# EAGLE design CNC-DROBoard (EAGLE 6.4)
CNC Control Panel DRO Board SPI Master/Slave interface with slave priority to main MCU 7-Segment LED displays and drivers Also reads REL/ABS and IN/MM buttons and controls their LEDs
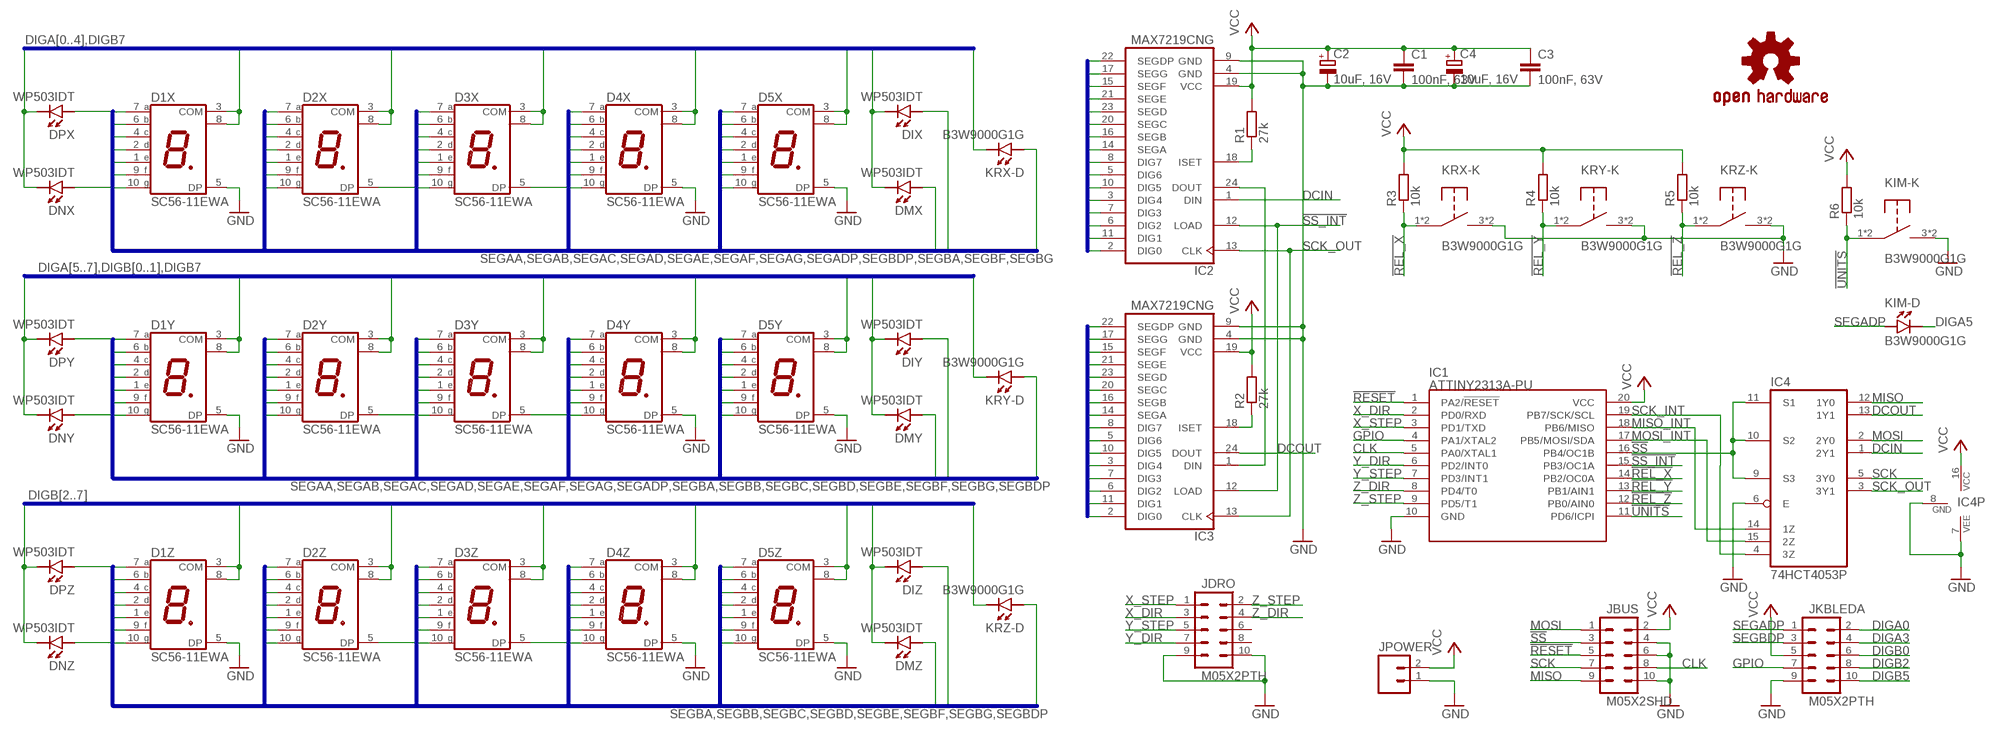
[diagram p0: schematic, sheet 1]

## Parts
C1  100nF, 63V  C-EU050-025X075  [C050-025X075]
C2  10uF, 16V  CPOL-EUE2,5-6E  [E2,5-6E]
C3  100nF, 63V  C-EU050-025X075  [C050-025X075]
C4  10uF, 16V  CPOL-EUE2,5-6E  [E2,5-6E]
D1X  SC56-11EWA  7-SEG_SA52-11  [SA52-11]
D1Y  SC56-11EWA  7-SEG_SA52-11  [SA52-11]
D1Z  SC56-11EWA  7-SEG_SA52-11  [SA52-11]
D2X  SC56-11EWA  7-SEG_SA52-11  [SA52-11]
D2Y  SC56-11EWA  7-SEG_SA52-11  [SA52-11]
D2Z  SC56-11EWA  7-SEG_SA52-11  [SA52-11]
D3X  SC56-11EWA  7-SEG_SA52-11  [SA52-11]
D3Y  SC56-11EWA  7-SEG_SA52-11  [SA52-11]
D3Z  SC56-11EWA  7-SEG_SA52-11  [SA52-11]
D4X  SC56-11EWA  7-SEG_SA52-11  [SA52-11]
D4Y  SC56-11EWA  7-SEG_SA52-11  [SA52-11]
D4Z  SC56-11EWA  7-SEG_SA52-11  [SA52-11]
D5X  SC56-11EWA  7-SEG_SA52-11  [SA52-11]
D5Y  SC56-11EWA  7-SEG_SA52-11  [SA52-11]
D5Z  SC56-11EWA  7-SEG_SA52-11  [SA52-11]
DIX  WP503IDT  [AXIAL__GENERIC_SQ_5X5]
DIY  WP503IDT  [AXIAL__GENERIC_SQ_5X5]
DIZ  WP503IDT  [AXIAL__GENERIC_SQ_5X5]
DMX  WP503IDT  [AXIAL__GENERIC_SQ_5X5]
DMY  WP503IDT  [AXIAL__GENERIC_SQ_5X5]
DMZ  WP503IDT  [AXIAL__GENERIC_SQ_5X5]
DNX  WP503IDT  [AXIAL__GENERIC_SQ_5X5]
DNY  WP503IDT  [AXIAL__GENERIC_SQ_5X5]
DNZ  WP503IDT  [AXIAL__GENERIC_SQ_5X5]
DPX  WP503IDT  [AXIAL__GENERIC_SQ_5X5]
DPY  WP503IDT  [AXIAL__GENERIC_SQ_5X5]
DPZ  WP503IDT  [AXIAL__GENERIC_SQ_5X5]
IC1  ATTINY2313A-PU  [DIL20]
IC2  MAX7219CNG  [DIL24-3]
IC3  MAX7219CNG  [DIL24-3]
IC4  74HCT4053P  [DIL16]
JBUS  M05X2SHD  [2X5-SHROUDED]
JDRO  M05X2PTH  [AVR_ICSP]
JKBLEDA  M05X2PTH  [AVR_ICSP]
JPOWER  M02POLAR  [MOLEX-1X2]
KIM  B3W9000G1G  [OMRON_B3W90]
KRX  B3W9000G1G  [OMRON_B3W90]
KRY  B3W9000G1G  [OMRON_B3W90]
KRZ  B3W9000G1G  [OMRON_B3W90]
R1  27k  R-EU_0207/10  [0207/10]
R2  27k  R-EU_0207/10  [0207/10]
R3  10k  R-EU_0207/10  [0207/10]
R4  10k  R-EU_0207/10  [0207/10]
R5  10k  R-EU_0207/10  [0207/10]
R6  10k  R-EU_0207/10  [0207/10]
U$1  SPARKFUN_OSHW-LOGOL  [SPARKFUN_OSHW-LOGO-L]

## Nets
!REL_X: IC1.14(PB2/OC0A) KRX.1 KRX.2 R3.1
!REL_Y: IC1.13(PB1/AIN1) KRY.1 KRY.2 R4.1
!REL_Z: IC1.12(PB0/AIN0) KRZ.1 KRZ.2 R5.1
!RESET: IC1.1(PA2/!RESET) JBUS.5
!SS: IC1.16(PB4/OC1B) IC4.9(S3) IC4.10(S2) IC4.11(S1) JBUS.3
!SS_INT: IC1.15(PB3/OC1A) IC2.12(LOAD) IC3.12(LOAD)
!UNITS: IC1.11(PD6/ICPI) KIM.1 KIM.2 R6.1
CLK: IC1.5(PA0/XTAL1) JBUS.8
DCIN: IC2.1(DIN) IC4.1(2Y1)
DCOUT: IC3.24(DOUT) IC4.13(1Y1)
DIGA0: D1X.3(COM) D1X.8(COM) IC2.2(DIG0) JKBLEDA.2
DIGA1: D2X.3(COM) D2X.8(COM) IC2.11(DIG1)
DIGA2: D3X.3(COM) D3X.8(COM) IC2.6(DIG2)
DIGA3: D4X.3(COM) D4X.8(COM) IC2.7(DIG3) JKBLEDA.4
DIGA4: D5X.3(COM) D5X.8(COM) IC2.3(DIG4) KRX.6(-D:K)
DIGA5: D1Y.3(COM) D1Y.8(COM) IC2.10(DIG5) KIM.6(-D:K)
DIGA6: D2Y.3(COM) D2Y.8(COM) IC2.5(DIG6)
DIGA7: D3Y.3(COM) D3Y.8(COM) IC2.8(DIG7)
DIGB0: D4Y.3(COM) D4Y.8(COM) IC3.2(DIG0) JKBLEDA.6
DIGB1: D5Y.3(COM) D5Y.8(COM) IC3.11(DIG1) KRY.6(-D:K)
DIGB2: D1Z.3(COM) D1Z.8(COM) IC3.6(DIG2) JKBLEDA.8
DIGB3: D2Z.3(COM) D2Z.8(COM) IC3.7(DIG3)
DIGB4: D3Z.3(COM) D3Z.8(COM) IC3.3(DIG4)
DIGB5: D4Z.3(COM) D4Z.8(COM) IC3.10(DIG5) JKBLEDA.10
DIGB6: D5Z.3(COM) D5Z.8(COM) IC3.5(DIG6) KRZ.6(-D:K)
DIGB7: DIX.2(K) DIY.2(K) DIZ.2(K) DMX.2(K) DMY.2(K) DMZ.2(K) DNX.2(K) DNY.2(K) DNZ.2(K) DPX.2(K) DPY.2(K) DPZ.2(K) IC3.8(DIG7)
GND: C1.2 C2.- C3.2 C4.- D1X.5(DP) D1Y.5(DP) D1Z.5(DP) D4X.5(DP) D4Y.5(DP) D4Z.5(DP) D5X.5(DP) D5Y.5(DP) D5Z.5(DP) IC1.10(GND) IC2.4(GND) IC2.9(GND) IC3.4(GND) IC3.9(GND) IC4.6(E) IC4.7(VEE) IC4.8(GND) JBUS.4 JBUS.6 JBUS.10 JDRO.9 JDRO.10 JKBLEDA.9 JPOWER.1 KIM.3 KIM.4 KRX.3 KRX.4 KRY.3 KRY.4 KRZ.3 KRZ.4
GPIO: IC1.4(PA1/XTAL2) JKBLEDA.7
MISO: IC4.12(1Y0) JBUS.9
MISO_INT: IC1.18(PB6/MISO) IC4.14(1Z)
MOSI: IC4.2(2Y0) JBUS.1
MOSI_INT: IC1.17(PB5/MOSI/SDA) IC4.15(2Z)
N$1: IC2.24(DOUT) IC3.1(DIN)
N$22: IC2.18(ISET) R1.1
N$24: IC3.18(ISET) R2.1
SCK: IC4.5(3Y0) JBUS.7
SCK_INT: IC1.19(PB7/SCK/SCL) IC4.4(3Z)
SCK_OUT: IC2.13(CLK) IC3.13(CLK) IC4.3(3Y1)
SEGAA: D1X.7(A) D1Y.7(A) D2X.7(A) D2Y.7(A) D3X.7(A) D3Y.7(A) D4X.7(A) D5X.7(A) IC2.14(SEGA)
SEGAB: D1X.6(B) D1Y.6(B) D2X.6(B) D2Y.6(B) D3X.6(B) D3Y.6(B) D4X.6(B) D5X.6(B) IC2.16(SEGB)
SEGAC: D1X.4(C) D1Y.4(C) D2X.4(C) D2Y.4(C) D3X.4(C) D3Y.4(C) D4X.4(C) D5X.4(C) IC2.20(SEGC)
SEGAD: D1X.2(D) D1Y.2(D) D2X.2(D) D2Y.2(D) D3X.2(D) D3Y.2(D) D4X.2(D) D5X.2(D) IC2.23(SEGD)
SEGADP: D2X.5(DP) D2Y.5(DP) D3X.5(DP) D3Y.5(DP) IC2.22(SEGDP) JKBLEDA.1 KIM.5(-D:A) KRX.5(-D:A)
SEGAE: D1X.1(E) D1Y.1(E) D2X.1(E) D2Y.1(E) D3X.1(E) D3Y.1(E) D4X.1(E) D5X.1(E) IC2.21(SEGE)
SEGAF: D1X.9(F) D1Y.9(F) D2X.9(F) D2Y.9(F) D3X.9(F) D3Y.9(F) D4X.9(F) D5X.9(F) IC2.15(SEGF)
SEGAG: D1X.10(G) D1Y.10(G) D2X.10(G) D2Y.10(G) D3X.10(G) D3Y.10(G) D4X.10(G) D5X.10(G) IC2.17(SEGG)
SEGBA: D1Z.7(A) D2Z.7(A) D3Z.7(A) D4Y.7(A) D4Z.7(A) D5Y.7(A) D5Z.7(A) DNX.1(A) IC3.14(SEGA)
SEGBB: D1Z.6(B) D2Z.6(B) D3Z.6(B) D4Y.6(B) D4Z.6(B) D5Y.6(B) D5Z.6(B) DPY.1(A) IC3.16(SEGB)
SEGBC: D1Z.4(C) D2Z.4(C) D3Z.4(C) D4Y.4(C) D4Z.4(C) D5Y.4(C) D5Z.4(C) DNY.1(A) IC3.20(SEGC)
SEGBD: D1Z.2(D) D2Z.2(D) D3Z.2(D) D4Y.2(D) D4Z.2(D) D5Y.2(D) D5Z.2(D) DPZ.1(A) IC3.23(SEGD)
SEGBDP: D2Z.5(DP) D3Z.5(DP) DPX.1(A) IC3.22(SEGDP) JKBLEDA.3 KRY.5(-D:A) KRZ.5(-D:A)
SEGBE: D1Z.1(E) D2Z.1(E) D3Z.1(E) D4Y.1(E) D4Z.1(E) D5Y.1(E) D5Z.1(E) DNZ.1(A) IC3.21(SEGE)
SEGBF: D1Z.9(F) D2Z.9(F) D3Z.9(F) D4Y.9(F) D4Z.9(F) D5Y.9(F) D5Z.9(F) DIX.1(A) DIY.1(A) DIZ.1(A) IC3.15(SEGF)
SEGBG: D1Z.10(G) D2Z.10(G) D3Z.10(G) D4Y.10(G) D4Z.10(G) D5Y.10(G) D5Z.10(G) DMX.1(A) DMY.1(A) DMZ.1(A) IC3.17(SEGG)
VCC: C1.1 C2.+ C3.1 C4.+ IC1.20(VCC) IC2.19(VCC) IC3.19(VCC) IC4.16(VCC) JBUS.2 JKBLEDA.5 JPOWER.2 R1.2 R2.2 R3.2 R4.2 R5.2 R6.2
X_DIR: IC1.2(PD0/RXD) JDRO.3
X_STEP: IC1.3(PD1/TXD) JDRO.1
Y_DIR: IC1.6(PD2/INT0) JDRO.7
Y_STEP: IC1.7(PD3/INT1) JDRO.5
Z_DIR: IC1.8(PD4/T0) JDRO.4
Z_STEP: IC1.9(PD5/T1) JDRO.2
Unconnected: JDRO.6 JDRO.8

## Buses
DIGA[0..4],DIGB7
SEGAA,SEGAB,SEGAC,SEGAD,SEGAE,SEGAF,SEGAG,SEGADP,SEGBDP,SEGBA,SEGBF,SEGBG
DIGA[5..7],DIGB[0..1],DIGB7
SEGAA,SEGAB,SEGAC,SEGAD,SEGAE,SEGAF,SEGAG,SEGADP,SEGBA,SEGBB,SEGBC,SEGBD,SEGBE,SEGBF,SEGBG,SEGBDP
DIGB[2..7]
SEGBA,SEGBB,SEGBC,SEGBD,SEGBE,SEGBF,SEGBG,SEGBDP
DIGA[0..7],SEGAA,SEGAB,SEGAC,SEGAD,SEGAE,SEGAF,SEGAG,SEGADP
DIGB[0..7],SEGBA,SEGBB,SEGBC,SEGBD,SEGBE,SEGBF,SEGBG,SEGBDP

## Library data of the parts
C1 C3 = rcl:C-EU: CAPACITOR, European symbol
C2 C4 = rcl:CPOL-EU: POLARIZED CAPACITOR, European symbol
D1X D1Y D1Z D2X D2Y D2Z D3X D3Y D3Z D4X D4Y D4Z D5X D5Y D5Z = display-kingbright:7-SEG_: Kingbright 14.2mm (0.56 INCH) SINGLE DIGIT NUMERIC DUISPLAY Source: SA56-11EWA(Ver1189471036.pdf; OC_FARNELL: unknown; OC_NEWARK: unknown
DIX DIY DIZ DMX DMY DMZ DNX DNY DNZ DPX DPY DPZ = radu-collected:WP503*: Kingbright WP503 series 5mm square LEDs
IC1 = SparkFun-DigitalIC-mine:ATTINY2313A: Atmel ATtiny2313A 2KiB Flash, 128 Bytes SRAM, 128 Bytes EEPROM 18 GPIO, USART, USI, picoPower DIP and SOIC packages provided
IC2 IC3 = maxim:MAX7219CNG: LED DISPLAY DRIVER; MF: MAXIM; MPN: MAX7219CNG; OC_FARNELL: 1523914; OC_NEWARK: 34C4018
IC4 = 74xx-eu:74*4053: Triple 2-channel analog multiplexer/demultiplexer Philips Semiconductor
JBUS JDRO JKBLEDA = SparkFun-Connectors:M05X2: Header 5x2 Standard 10-pin dual row 0.1" header. Commonly used with AVR-ISP. Use with Spark Fun Electronics SKU: PRT-00778
JPOWER = SparkFun-Connectors:M02: Header 2 Standard 2-pin 0.1" header. Use with straight break away headers (SKU : PRT-00116), right angle break away headers (PRT-00553), swiss pins (PRT-00743), machine pins (PRT-00117), and female headers (PRT-00115). Molex polarized connector foot print use with SKU : PRT-08233 with associated crimp pins and housings.
KIM KRX KRY KRZ = radu-collected:B3W90*: OMRON B3W-90 series illuminated pushbutton swtiches
R1-R6 = rcl:R-EU_: RESISTOR, European symbol
U$1 = Si4735_Breakout-v10:SPARKFUN_OSHW-LOGO: Open Source Hardware Logo This logo indicates the piece of hardware it is found on incorporates a OSHW license and/or adheres to the definition of open source hardware found here: http://freedomdefined.org/OSHW

## Board
CNC Control Panel - DRO Version 1.0 (20121117) This version was the first to be manufactured at TinyOSShop, silkscreen reads "20121117" Routing was done in FreeRouting via .DSN, the result imported back via .SCR and manually adjusted to match DRU
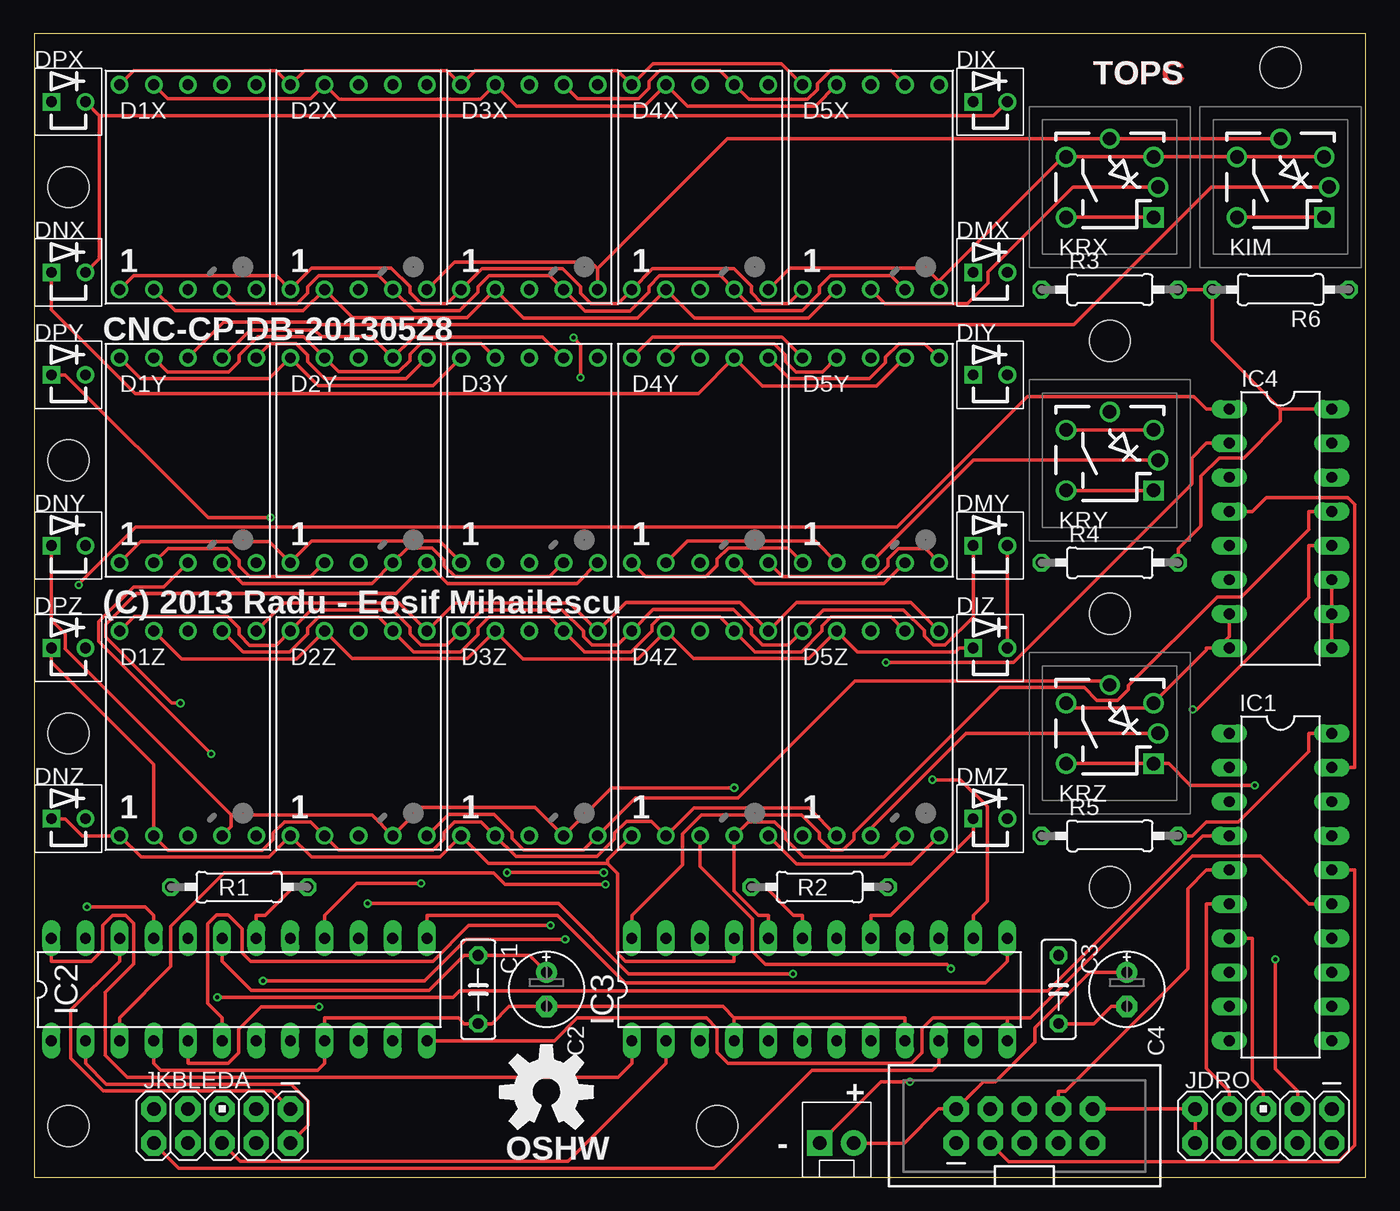
[diagram p1: board, top side]
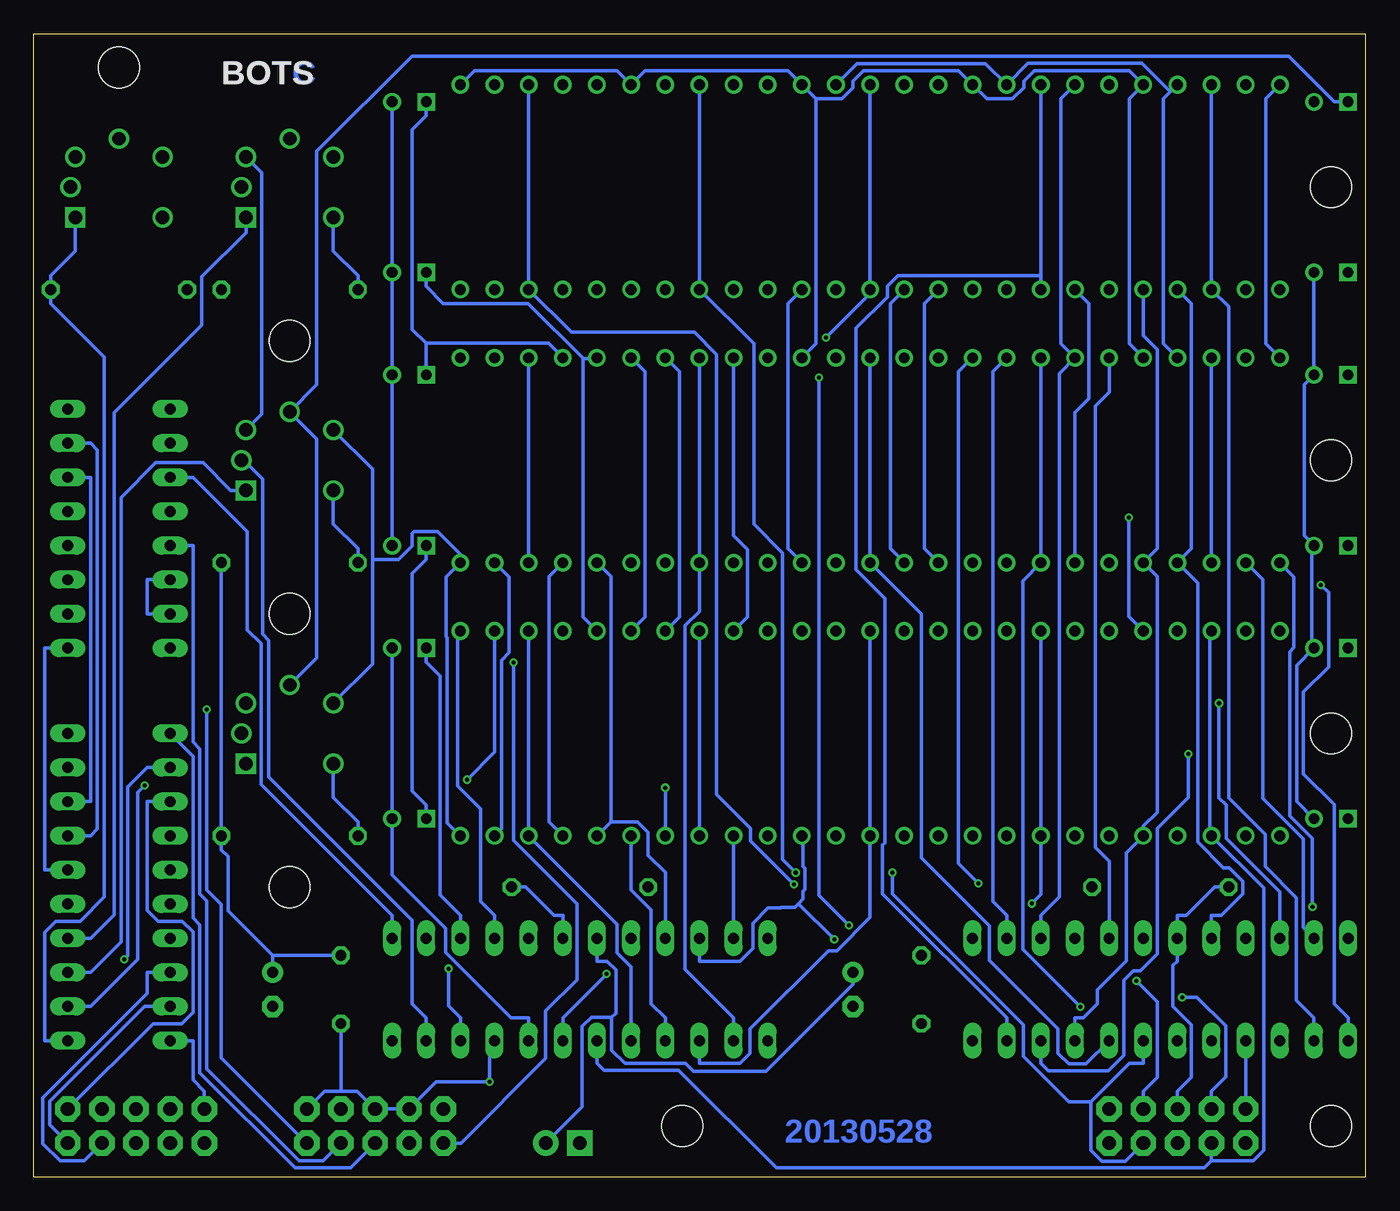
[diagram p2: board, bottom side, seen from below]

Size 99.06 x 85.08 mm. Coordinates in mm from the lower left corner, seen from the top.
Outline: 0,0 99.06,0 99.06,85.08 0,85.08 0,0
Copper layers (1*16): Top 0.035mm / dielectric 1.5mm / Bottom 0.035mm
Design rules "ITEADstudio_DRC": minimum track width 10mil, minimum drill 12mil, track to track 10mil, track to pad 10mil, pad to pad 10mil, via to via 10mil, smd to smd 0mil, copper to edge 20mil, drill to drill 10mil, minimum pad ring 10mil, minimum via ring 6mil, stop-mask expansion 4mil, vias tented up to drill 100mil, thermal gap 10mil
Holes 3.05 mm at 2.54,73.66 2.54,33.02 80.01,62.23 92.71,82.55 80.01,41.91 80.01,21.59 2.54,3.81 2.54,53.34 50.8,3.81

### Footprints (pad centres in the part's own frame; a part is rotated, then mirrored left to right if it is on the bottom)
C050-025X075 = drill 0.813 octagon: 1 -2.54,0; 2 2.54,0
E2,5-6E = drill 0.813 pad 1.575: + -1.27,0 | drill 0.813 pad 1.575 octagon: - 1.27,0
SA52-11 = drill 0.8: 1 -5.08,-7.62; 2 -2.54,-7.62; 3 0,-7.62; 4 2.54,-7.62; 5 5.08,-7.62; 6 5.08,7.62; 7 2.54,7.62; 8 0,7.62; 9 -2.54,7.62; 10 -5.08,7.62
AXIAL__GENERIC_SQ_5X5 = drill 0.8 square: 1 -1.27,0 | drill 0.8: 2 1.27,0
DIL20 = drill 0.813 long: 1 -11.43,-3.81; 2 -8.89,-3.81; 3 -6.35,-3.81; 4 -3.81,-3.81; 5 -1.27,-3.81; 6 1.27,-3.81; 7 3.81,-3.81; 8 6.35,-3.81; 9 8.89,-3.81; 10 11.43,-3.81; 11 11.43,3.81; 12 8.89,3.81; 13 6.35,3.81; 14 3.81,3.81; 15 1.27,3.81; 16 -1.27,3.81; 17 -3.81,3.81; 18 -6.35,3.81; 19 -8.89,3.81; 20 -11.43,3.81
DIL24-3 = drill 0.813 long: 1 -13.97,-3.81; 2 -11.43,-3.81; 3 -8.89,-3.81; 4 -6.35,-3.81; 5 -3.81,-3.81; 6 -1.27,-3.81; 7 1.27,-3.81; 8 3.81,-3.81; 9 6.35,-3.81; 10 8.89,-3.81; 11 11.43,-3.81; 12 13.97,-3.81; 13 13.97,3.81; 14 11.43,3.81; 15 8.89,3.81; 16 6.35,3.81; 17 3.81,3.81; 18 1.27,3.81; 19 -1.27,3.81; 20 -3.81,3.81; 21 -6.35,3.81; 22 -8.89,3.81; 23 -11.43,3.81; 24 -13.97,3.81
DIL16 = drill 0.813 long: 1 -8.89,-3.81; 2 -6.35,-3.81; 3 -3.81,-3.81; 4 -1.27,-3.81; 5 1.27,-3.81; 6 3.81,-3.81; 7 6.35,-3.81; 8 8.89,-3.81; 9 8.89,3.81; 10 6.35,3.81; 11 3.81,3.81; 12 1.27,3.81; 13 -1.27,3.81; 14 -3.81,3.81; 15 -6.35,3.81; 16 -8.89,3.81
2X5-SHROUDED = drill 1.016 pad 1.88 octagon: 1 -1.27,5.08; 2 1.27,5.08; 3 -1.27,2.54; 4 1.27,2.54; 5 -1.27,0; 6 1.27,0; 7 -1.27,-2.54; 8 1.27,-2.54; 9 -1.27,-5.08; 10 1.27,-5.08
AVR_ICSP = drill 1.016 pad 1.88 octagon: 1 -1.27,5.08; 2 1.27,5.08; 3 -1.27,2.54; 4 1.27,2.54; 5 -1.27,0; 6 1.27,0; 7 -1.27,-2.54; 8 1.27,-2.54; 9 -1.27,-5.08; 10 1.27,-5.08
MOLEX-1X2 = drill 1.016 pad 1.88 square: 1 0,0 | drill 1.016 pad 1.88: 2 2.54,0
OMRON_B3W90 = drill 1 square: 1 3.25,-2.25 | drill 1: 2 -3.25,-2.25; 3 3.25,2.25; 4 -3.25,2.25; 5 0,3.6; 6 3.6,0
0207/10 = drill 0.813 octagon: 1 -5.08,0; 2 5.08,0

### Placement (x,y rotation side)
C1  33.02,13.97 270 top
C2  38.1,13.97 270 top
C3  76.2,13.97 270 top
C4  81.28,13.97 270 top
D1X  11.43,73.66 0 top
D1Y  11.43,53.34 0 top
D1Z  11.43,33.02 0 top
D2X  24.13,73.66 0 top
D2Y  24.13,53.34 0 top
D2Z  24.13,33.02 0 top
D3X  36.83,73.66 0 top
D3Y  36.83,53.34 0 top
D3Z  36.83,33.02 0 top
D4X  49.53,73.66 0 top
D4Y  49.53,53.34 0 top
D4Z  49.53,33.02 0 top
D5X  62.23,73.66 0 top
D5Y  62.23,53.34 0 top
D5Z  62.23,33.02 0 top
DIX  71.12,80.01 0 top
DIY  71.12,59.69 0 top
DIZ  71.12,39.37 0 top
DMX  71.12,67.31 0 top
DMY  71.12,46.99 0 top
DMZ  71.12,26.67 0 top
DNX  2.54,67.31 0 top
DNY  2.54,46.99 0 top
DNZ  2.54,26.67 0 top
DPX  2.54,80.01 0 top
DPY  2.54,59.69 0 top
DPZ  2.54,39.37 0 top
IC1  92.71,21.59 270 top
IC2  15.24,13.97 0 top
IC3  58.42,13.97 0 top
IC4  92.71,48.26 270 top
JBUS  73.66,3.81 90 top
JDRO  91.44,3.81 270 top
JKBLEDA  13.97,3.81 270 top
JPOWER  58.42,2.54 0 top
KIM  92.71,73.66 0 top
KRX  80.01,73.66 0 top
KRY  80.01,53.34 0 top
KRZ  80.01,33.02 0 top
R1  15.24,21.59 180 top
R2  58.42,21.59 180 top
R3  80.01,66.04 0 top
R4  80.01,45.72 0 top
R5  80.01,25.4 0 top
R6  92.71,66.04 180 top
U$1  38.1,6.35 0 top

### Tracks (layer width: path | path; a pad name or v marks a point on that pad's centre or on a via)
!REL_X
  Top 0.254: KRX.2 KRX.1
  Bottom 0.254: IC1.14 94.82,17.78 93.07,19.53 93.07,56.88 86.55,63.4 86.55,66.98 83.26,70.28 KRX.1 | R3.1 74.93,67.08 76.76,68.91 KRX.2
!REL_Y
  Top 0.254: KRY.2 KRY.1
  Bottom 0.254: IC1.13 94.82,15.24 92.56,17.5 92.56,50.56 89.97,53.15 86.45,53.15 84.39,51.09 KRY.1 | R4.1 74.93,46.76 76.76,48.59 KRY.2
!REL_Z  (via drill 0.3 pad 0.61)
  Top 0.254: v90.81,29.15 86.02,29.15 84.39,30.77 KRZ.1 KRZ.2
  Bottom 0.254: IC1.12 94.82,12.7 91.32,16.2 91.32,28.64 v90.81,29.15 | R5.1 74.93,26.44 76.76,28.27 KRZ.2
!RESET
  Bottom 0.254: IC1.1 87.2,31.32 87.2,19.29 86.69,18.78 86.69,7.78 79.61,0.71 75.49,0.71 JBUS.5
!SS
  Top 0.254: IC4.11 IC4.10 IC4.9 | IC1.16 98.22,22.86 98.22,2.37 97.02,1.17 72.49,1.17 JBUS.3
  Bottom 0.254: IC1.16 98.22,22.86 98.22,39.37 IC4.9
!SS_INT
  Top 0.254: 72.39,11.86 74.09,11.86 86.15,23.92 91.22,23.92 94.82,20.32 IC1.15 | 72.39,11.86 66.86,11.86 66.04,11.04 66.04,9.26 65.23,8.46 51.62,8.46 50.8,9.28 50.8,11.05 49.99,11.86 40.39,11.86 38.69,10.16 IC2.12 | IC3.12 72.39,11.86
!UNITS
  Top 0.254: KIM.2 KIM.1
  Bottom 0.254: IC1.11 98.22,10.16 98.22,18.23 97.41,19.05 95.61,19.05 93.8,20.86 93.8,61.01 97.79,65 R6.1 97.79,66.56 97.79,67.08 95.96,68.91 KIM.1
CLK
  Top 0.254: IC1.5 87.2,22.86 85.81,21.47 85.81,15.51 76.69,6.4 76.2,6.4 JBUS.8
DCIN  (via drill 0.3 pad 0.61)
  Top 0.254: IC4.1 87.2,57.15 86.27,58.08 73.87,58.08 64.17,48.38 7.53,48.38 3.3,44.15 v3.3,44.06
  Bottom 0.254: IC2.1 1.27,11.86 2.31,12.9 2.31,27.73 4.59,30.01 4.59,36.09 2.73,37.96 2.73,43.5 v3.3,44.06
DCOUT
  Top 0.254: IC3.24 44.45,19.48 48.2,23.24 48.2,25.54 49.62,26.96 57.06,26.96 58.42,25.6 58.42,25.17 59.25,24.34 60.17,24.34 60.96,25.13 60.96,25.6 71.78,36.42 78.12,36.42 79.06,35.48 80.58,35.48 81.39,36.3 81.39,36.57 88,43.18 89.81,43.18 94.82,48.19 94.82,49.53 IC4.13
DIGA0
  Top 0.254: JKBLEDA.2 20.37,3.86 20.37,5.66 19.11,6.93 5.34,6.93 3.81,8.46 IC2.2
  Bottom 0.254: D1X.8 D1X.3 10.16,64.77 10.16,28.23 7.44,25.51 7.44,23.12 5.12,20.79 5.12,13.17 3.81,11.86 IC2.2
DIGA1
  Bottom 0.254: 24.13,67.08 D2X.3 | D2X.8 24.13,67.08 | 24.13,67.08 34.76,67.08 35.56,66.28 35.56,65.49 37.9,63.15 37.9,45.23 35.73,43.06 35.73,24.88 35.9,24.71 35.9,21.09 26.67,11.86 IC2.11
DIGA2  (via drill 0.3 pad 0.61)
  Top 0.254: v38.4,18.74 32.32,18.74 29.66,16.07 16.08,16.07 15.47,16.69 15.47,18.49 14.44,19.52 13.55,19.52 12.88,18.85 12.88,12.95 13.97,11.86 IC2.6 | v40.64,59.48 40.64,61.92 v40.11,62.45
  Bottom 0.254: v40.64,59.48 40.64,20.98 v38.4,18.74 | v40.11,62.45 36.83,65.73 D3X.3 D3X.8
DIGA3  (via drill 0.3 pad 0.61)
  Top 0.254: v42.37,22.66 v35.16,22.66
  Bottom 0.254: 20.41,5.59 22.05,5.59 25.44,8.98 25.44,11.36 35.16,21.08 v35.16,22.66 | v42.37,22.66 43.36,23.66 43.36,46.45 45.49,48.58 45.49,62 D4X.3 D4X.8 | 20.41,5.59 17.54,8.46 16.51,8.46 IC2.7 | JKBLEDA.4 17.85,1.2 19.58,1.2 20.41,2.02 20.41,5.59
DIGA4  (via drill 0.3 pad 0.61)
  Top 0.254: v42.48,21.79 35.02,21.79 34.17,22.64 14.14,22.64 10.16,18.66 10.16,15.67 6.35,11.86 IC2.3 | KRX.6 77.27,73.66 70.94,67.33 70.94,66.53 69.41,65 63.27,65 D5X.3
  Bottom 0.254: v42.48,21.79 45.72,25.02 45.72,25.95 48.26,28.49 48.26,61.2 49.91,62.86 59.05,62.86 D5X.3 D5X.8
DIGA5  (via drill 0.3 pad 0.61)
  Top 0.254: KIM.6 87.57,73.66 77.33,63.42 21.19,63.42 21,63.61 14.08,63.61 D1Y.8 | v13.16,31.49 4.8,39.84 4.8,41.34 7.38,43.92 9.63,43.92 D1Y.3
  Bottom 0.254: v13.16,31.49 13.16,28.24 15.46,25.93 15.46,16.63 16.73,15.36 17.25,15.36 17.95,14.66 17.95,9.08 19.12,7.91 23.59,7.91 24.13,8.46 IC2.10 | D1Y.3 D1Y.8
DIGA6  (via drill 0.3 pad 0.61)
  Top 0.254: v21.19,12.68 16.88,12.68 15.2,11 15.2,9.24 14.42,8.46 11.43,8.46 IC2.5
  Bottom 0.254: v21.19,12.68 25.48,16.97 25.48,44.37 D2Y.3 D2Y.8
DIGA7
  Bottom 0.254: IC2.8 20.79,8.42 22.06,8.42 22.86,9.22 22.86,11.04 27.94,16.12 27.94,18.69 33.02,23.77 33.02,41.91 D3Y.3 D3Y.8
DIGB0
  Top 0.254: IC3.2 46.99,8.46 39.72,1.19 15.32,1.19 JKBLEDA.6
  Bottom 0.254: IC3.2 46.99,11.86 50.6,15.47 50.6,41.03 49.53,42.1 D4Y.3 D4Y.8
DIGB1
  Top 0.254: D5Y.3 69.85,53.34 KRY.6
  Bottom 0.254: KRY.6 83.44,53.34 82.03,51.93 82.03,40.41 81.56,39.93 81.56,29.77 70.89,19.1 70.89,12.9 69.85,11.86 IC3.11 | D5Y.8 D5Y.3
DIGB2
  Bottom 0.254: 11.43,1.22 11.96,0.69 43.8,0.69 51.07,7.95 56.64,7.95 57.15,8.46 IC3.6 | 11.43,1.22 8.31,1.22 7.54,1.99 7.54,21.51 D1Z.3 11.56,25.53 11.56,40.51 D1Z.8 | JKBLEDA.8 11.43,1.22
DIGB3  (via drill 0.3 pad 0.61)
  Top 0.254: v56.45,15.14 44.21,15.14 38.99,20.36 v24.8,20.36
  Bottom 0.254: v24.8,20.36 24.13,21.03 D2Z.3 D2Z.8 | v56.45,15.14 56.45,15.1 59.69,11.86 IC3.7
DIGB4
  Bottom 0.254: IC3.3 49.53,8.46 46.53,8.46 45.76,9.23 45.76,11.03 39.93,16.86 39.3,16.86 36.83,19.33 D3Z.3 D3Z.8
DIGB5  (via drill 0.3 pad 0.61)
  Top 0.254: v68.2,15.51 67.88,15.83 54.41,15.83 53.42,16.81 53.42,19.23 49.53,23.12 D4Z.3 | JKBLEDA.10 10.75,0.68 50.57,0.68 57.85,7.95 66.8,7.95 67.31,8.46 IC3.10
  Bottom 0.254: v68.2,15.51 68.2,12.75 67.31,11.86 IC3.10 | D4Z.8 D4Z.3
DIGB6
  Top 0.254: KRZ.6 69.3,33.02 62.23,25.95 D5Z.3
  Bottom 0.254: D5Z.8 D5Z.3 55.65,18.82 55.65,16.69 54.61,15.65 IC3.5
DIGB7
  Top 0.254: 4.84,78.97 DPX.2 | DIX.2 71.36,78.97 4.84,78.97 | 4.84,78.97 4.84,68.34 DNX.2 | DMY.2 DIZ.2
  Bottom 0.254: IC3.8 62.23,11.86 63.52,11.86 68.4,16.74 68.4,18.51 72.39,22.5 DMZ.2 DIZ.2 | DNX.2 DPY.2 4.55,58.95 4.55,47.73 DNY.2 3.98,46.82 3.98,39.54 DPZ.2 5.1,38.08 5.1,27.96 DNZ.2 | DIX.2 DMX.2 DIY.2 DMY.2
GND  (via drill 0.3 pad 0.61)
  Top 0.254: D4Z.5 56.69,23.32 65.23,23.32 D5Z.5 | IC2.4 8.89,8.46 9.4,7.94 21.07,7.94 21.59,8.46 IC2.9 21.59,10.54 21.59,11.86 31.55,11.86 31.98,11.43 C1.2 34.06,11.43 35.33,12.7 C2.- 39.27,12.7 51.23,12.7 52.07,11.86 | v65.14,7.09 62.97,7.09 JPOWER.1 | IC3.9 64.77,11.86 52.07,11.86 | C4.- 80.11,12.7 78.84,11.43 C3.2 | 67.31,66.67 D5X.5 | 67.31,66.67 76.55,75.91 KRX.4 KRX.3 KIM.4 KIM.3 | D4X.5 56.21,67.64 66.34,67.64 67.31,66.67 | KRY.4 KRY.3 | D5Y.5 66.28,46.76 64.27,46.76 63.5,45.99 63.5,45.48 62.7,44.68 55.65,44.68 D4Y.5 | KRZ.4 77.11,34.92 82.91,34.92 KRZ.3 87.2,39.21 87.2,39.37 88.05,39.37 | IC3.4 52.07,11.86 | 88.05,39.37 88.9,40.22 IC4.7 | IC4.8 88.05,39.37 | JBUS.10 JDRO.9 86.36,3.86 JDRO.10
  Bottom 0.254: D5Z.5 68.29,26.38 68.29,40.15 68.38,40.24 68.38,44.66 D5Y.5 67.31,46.32 69.02,48.02 70.75,48.02 70.89,47.89 70.89,46.95 71.89,45.94 73.86,45.94 | IC3.4 52.07,11.86 53.11,12.9 53.11,19.89 54.61,21.39 D4Z.5 | IC2.9 21.59,11.86 20.97,11.86 19.94,12.89 19.94,13.94 17.78,16.1 17.78,24.13 D1Z.5 16.51,26.12 15.47,27.16 15.47,44.68 D1Y.5 15.46,46.77 15.46,61.56 16.51,62.6 D1X.5 | KRY.3 82.08,56.77 82.08,74.73 KRX.3 | 73.86,45.94 73.86,52.69 KRY.4 | KRZ.4 73.86,38.17 73.86,45.94 | IC3.9 64.77,9.31 65.14,8.94 v65.14,7.09 69.11,7.09 JBUS.4 72.34,5.08 JBUS.6 74.98,6.4 76.2,6.4 | IC1.10 87.2,10.16 87.2,7.24 86.36,6.4 JDRO.9 | IC4.6 90.6,44.45 90.6,41.91 IC4.7 | JBUS.10 77.42,6.4 76.2,6.4 | 76.2,6.4 C3.2 | JKBLEDA.9 IC2.4
GPIO  (via drill 0.3 pad 0.61)
  Top 0.254: v13.62,13.39 31.17,13.39 31.65,13.88 75.39,13.88 86.91,25.4 IC1.4
  Bottom 0.254: v13.62,13.39 12.52,13.39 10.37,11.24 10.37,7.46 11.43,6.4 JKBLEDA.7
MISO  (via drill 0.3 pad 0.61)
  Top 0.254: v86.18,34.79 86.49,34.79 94.82,43.12 94.82,46.99 IC4.12
  Bottom 0.254: JBUS.9 85.09,8.89 85.09,20.29 86.18,21.38 v86.18,34.79
MISO_INT
  Bottom 0.254: IC1.18 94.82,27.94 94.82,52.07 IC4.14
MOSI  (via drill 0.3 pad 0.61)
  Top 0.254: v63.35,38.3 72.84,38.3 86.1,51.56 86.1,53.51 87.2,54.61 IC4.2
  Bottom 0.254: v63.35,38.3 63.35,25.05 58.63,20.34 58.63,14.69 60.96,12.37 60.96,8.84 67.26,2.54 JBUS.1
MOSI_INT
  Bottom 0.254: IC1.17 94.82,25.4 94.31,25.91 94.31,54.1 94.82,54.61 IC4.15
N$1
  Top 0.254: IC2.24 1.27,16.08 4.25,16.08 5.08,16.91 5.08,18.75 5.82,19.48 6.8,19.48 7.4,18.88 7.4,15.89 5.29,13.77 5.29,9.05 6.9,7.43 43.43,7.43 44.45,8.46 IC3.1
N$22
  Top 0.254: IC2.18 16.51,19.48 17.17,19.48 19.28,21.59 R1.1
N$24
  Bottom 0.254: IC3.18 59.69,19.48 60.35,19.48 62.46,21.59 R2.1
SCK
  Bottom 0.254: IC4.5 87.2,46.99 87.2,32.38 86.69,31.88 86.69,21.07 86.18,20.56 86.18,8.07 79.32,1.21 77.53,1.21 JBUS.7
SCK_INT
  Top 0.254: IC1.19 98.22,30.48 98.22,50.05 97.69,50.57 91.64,50.57 90.6,49.53 IC4.4
SCK_OUT
  Top 0.254: IC2.13 29.21,19.48 38.92,19.48 43.95,14.45 70.76,14.45 72.39,16.08 IC3.13
  Bottom 0.254: IC3.13 72.39,19.48 82.12,29.22 82.12,39.69 83.16,40.73 83.16,48.03 87.2,52.07 IC4.3
SEGAA
  Top 0.254: D5X.7 63.72,82.33 59.23,82.33 58.26,81.36 58.26,80.92 57.53,80.2 53.15,80.2 D4X.7 51.02,82.33 46.53,82.33 45.72,81.52 45.72,81.01 44.93,80.22 40.42,80.22 D3X.7 | D3Y.7 37.82,62.51 28.22,62.51 D2Y.7 25.1,62.53 21.37,62.53 20.86,63.03 16.04,63.03 D1Y.7
  Bottom 0.254: IC2.14 26.67,19.48 27.71,20.52 27.71,59.92 D2Y.7 | D3X.7 37.8,82.85 28.24,82.85 D2X.7 25.08,82.87 16.62,82.87 14.5,80.75 | 14.5,80.75 D1X.7 | D1Y.7 15.01,62 15.01,80.24 14.5,80.75
SEGAB  (via drill 0.3 pad 0.61)
  Top 0.254: IC2.16 21.59,19.48 23.97,21.86 v28.77,21.86 | D1Y.6 17.56,62.01 19.47,62.01 20.32,61.16 20.32,60.69 21.6,59.41 27.66,59.41 D2Y.6
  Bottom 0.254: v28.77,21.86 30.25,23.35 30.25,59.92 D2Y.6 | D1Y.6 17.56,62.01 17.56,80.23 D1X.6 17.56,82.33 24.62,82.33 25.4,81.56 25.4,81.06 26.23,80.22 28.15,80.22 D2X.6 30.26,82.33 37.32,82.33 38.1,81.56 38.1,81.06 38.93,80.22 40.85,80.22 | D5X.6 66.27,82.32 55.65,82.32 D4X.6 53.58,82.31 42.95,82.31 D3X.6 40.85,80.22 | D3Y.6 40.85,62.02 40.85,80.22
SEGAC
  Top 0.254: D5X.4 63.73,67.08 59.24,67.08 58.42,66.26 58.42,65.77 57.14,64.49 53.62,64.49 D4X.4 51.03,67.08 46.53,67.08 45.72,66.27 45.72,65.83 44.33,64.44 40.97,64.44 D3X.4 38.34,67.08 33.83,67.08 33.02,66.27 33.02,65.84 31.64,64.46 28.25,64.46 D2X.4 25.63,67.08 21.15,67.08 20.32,66.25 20.32,65.78 19.54,65 15.01,65 D1X.4 | D3Y.4 38.33,44.68 31.29,44.68 30.48,45.49 30.48,45.92 29.6,46.8 27.75,46.8 D2Y.4 25.12,44.17 15.52,44.17 D1Y.4
  Bottom 0.254: IC2.20 11.43,19.48 10.71,19.48 9.1,21.09 9.1,22.01 10.1,23.01 10.54,23.01 12.46,24.93 12.46,44.22 D1Y.4 12.93,46.76 12.93,65 D1X.4
SEGAD
  Top 0.254: D5X.2 57.58,63.93 49.1,63.93 D4X.2 44.88,63.93 36.4,63.93 D3X.2 32.2,63.95 23.68,63.95 D2X.2 20.01,64.46 10.47,64.46 D1X.2 | D1Y.2 9.95,46.78 14.38,46.78 15.24,45.93 15.24,45.45 16.01,44.68 20.55,44.68 D2Y.2
  Bottom 0.254: D3X.2 35.33,65 35.33,46.76 D3Y.2 | D2Y.2 21.59,56.9 20.55,57.94 20.55,65 D2X.2 | IC2.23 4.61,18.58 4.61,25.17 7.62,28.18 7.62,44.45 D1Y.2
SEGADP  (via drill 0.3 pad 0.61)
  Top 0.254: JKBLEDA.1 17.71,6.42 5.13,6.42 2.71,8.84 2.71,12.44 6.35,16.08 IC2.22 | D3Y.5 40.36,44.17 30.76,44.17 D2Y.5 26.9,43.41 7.59,43.41 5.32,41.14 5.32,40.18 10.23,35.27 v10.87,35.27 | 41.91,67.6 41.42,68.09 31.26,68.09 D2X.5 | 41.91,67.6 D3X.5 | 41.91,67.6 51.57,77.26 KRX.5 KIM.5
  Bottom 0.254: IC2.22 6.35,21.22 10.34,25.21 10.34,27.69 10.87,28.23 v10.87,35.27 | D3X.5 42.95,65 42.95,46.76 D3Y.5
SEGAE  (via drill 0.3 pad 0.61)
  Top 0.254: v3.92,20.13 8.25,20.13 8.89,19.48 IC2.21 | v3.92,20.13 | D3Y.1 30.16,47.31 20.64,47.31 D2Y.1 17.47,47.3 7.93,47.3 D1Y.1 | D5X.1 56.11,65 54.13,65 53.34,65.79 53.34,66.3 52.05,67.59 46,67.59 D4X.1 43.41,65 41.42,65 40.64,65.77 40.64,66.25 39.31,67.58 33.29,67.58 D3X.1 30.69,64.98 28.77,64.98 27.94,65.81 27.94,66.25 26.56,67.63 20.64,67.63 D2X.1 18.01,67.08 7.39,67.08 D1X.1
  Bottom 0.254: D1Y.1 5.3,44.67 5.3,39.39 5.61,39.08 5.61,26.89 3.92,25.2 v3.92,20.13 | D3X.1 32.79,65 32.79,46.76 D3Y.1
SEGAF
  Top 0.254: D1X.9 9.93,80.24 20.55,80.24 D2X.9 22.67,80.2 33.21,80.2 D3X.9 35.88,79.69 45.4,79.69 D4X.9 48.58,79.69 58.1,79.69 D5X.9 | D1Y.9 9.94,59.91 14.46,59.91 15.24,60.69 15.24,61.16 16.61,62.53 20.02,62.53 D2Y.9 22.63,59.92 27.11,59.92 27.94,60.75 27.94,61.22 28.73,62 33.25,62 D3Y.9
  Bottom 0.254: D2X.9 22.63,80.24 22.63,62 D2Y.9 22.75,59.8 22.75,20.86 24.13,19.48 IC2.15
SEGAG
  Top 0.254: D3Y.10 29.68,58.89 21.12,58.89 D2Y.10 17.49,59.4 7.91,59.4 D1Y.10 | D1X.10 7.4,82.33 18,82.33 D2X.10 20.1,82.33 30.7,82.33 D3X.10 32.8,82.33 43.4,82.33 D4X.10 46.01,82.84 55.59,82.84 D5X.10
  Bottom 0.254: IC2.17 19.05,23.49 20.09,24.53 20.09,57.38 19.05,58.42 D2Y.10 | D1Y.10 7.39,62 7.39,80.24 D1X.10
SEGBA  (via drill 0.3 pad 0.61)
  Top 0.254: DNX.1 1.27,64.55 7.5,58.32 49.43,58.32 D4Y.7 54.19,58.84 62.66,58.84 D5Y.7 | D5Z.7 63.73,41.67 59.26,41.67 58.6,41.01 58.6,40.62 57.07,39.09 53.62,39.09 D4Z.7 51.02,41.69 46.55,41.69 45.95,41.1 45.95,40.63 44.4,39.08 40.93,39.08 D3Z.7 38.32,41.69 33.85,41.69 33.02,40.86 33.02,40.39 31.73,39.09 28.22,39.09 D2Z.7 25.62,41.69 21.14,41.69 20.32,40.87 20.32,40.4 18.98,39.06 15.54,39.06 D1Z.7 | IC3.14 69.85,19.48 70.89,20.52 70.89,27.57 68.89,29.57 v66.82,29.57
  Bottom 0.254: D4Z.7 51.03,41.68 51.03,59.92 D4Y.7 | v66.82,29.57 64.77,31.63 D5Z.7
SEGBB  (via drill 0.3 pad 0.61)
  Top 0.254: D5Z.6 65.2,42.74 56.72,42.74 D4Z.6 52.51,42.74 44.01,42.74 D3Z.6 39.82,42.73 31.3,42.73 D2Z.6 27.14,42.71 18.58,42.71 D1Z.6 | D4Y.6 56.16,59.41 62.14,59.41 63.33,60.6 63.33,61.01 64.32,62 66.27,62 D5Y.6 | v17.59,49.07 12.93,49.07 2.31,59.69 DPY.1
  Bottom 0.254: IC3.16 64.77,19.48 65.81,20.52 65.81,27.4 67.52,29.11 67.52,40.43 D5Z.6 | D4Z.6 53.57,41.68 53.57,59.92 D4Y.6 | v17.59,49.07 17.59,41.72 D1Z.6
SEGBC  (via drill 0.3 pad 0.61)
  Top 0.254: D5Z.4 63.2,23.83 57.23,23.83 55.88,25.18 55.88,25.64 55.07,26.45 53.12,26.45 D4Z.4 52.07,21.3 53.89,19.48 54.61,19.48 IC3.20 | v52.07,28.98 42.95,28.98 D3Z.4 37.26,27.51 28.78,27.51 D2Z.4 25.12,26.95 14.66,26.95 | 14.66,26.95 14.66,26.09 D1Z.4 | 14.66,26.95 2.31,39.3 2.31,40.41 1.27,41.45 1.27,45.95 DNY.1 | D4Y.4 53.62,44.17 63.22,44.17 D5Y.4
  Bottom 0.254: D4Z.4 v52.07,28.98 | D5Z.4 64.26,25.91 64.26,38.46 63.69,39.03 63.69,44.64 D5Y.4
SEGBD
  Top 0.254: D5Z.2 57.62,27.47 49.06,27.47 D4Z.2 45.9,26.49 44.07,26.49 43.18,25.6 43.18,25.17 41.87,23.86 35.83,23.86 D3Z.2 33.25,26.44 31.25,26.44 30.48,25.67 30.48,25.16 29.66,24.34 22.65,24.34 D2Z.2 20.55,26.44 18.62,26.44 17.78,25.6 17.78,25.14 16.96,24.32 9.97,24.32 D1Z.2 8.89,30.71 1.27,38.34 DPZ.1 | D5Y.2 58.1,47.31 48.58,47.31 D4Y.2
  Bottom 0.254: D5Z.2 60.73,26.43 60.73,44.69 D5Y.2 | D4Z.2 46.99,18.63 IC3.23
SEGBDP  (via drill 0.3 pad 0.61)
  Top 0.254: v39.5,17.7 32.11,17.7 29.02,14.61 v17.01,14.61 | D2Z.5 30.81,27 34.22,27 35.56,25.66 35.56,25.19 36.39,24.36 40.88,24.36 D3Z.5 44.73,28.22 52.35,28.22 61.05,36.93 79.7,36.93 KRZ.5
  Bottom 0.254: D3Z.5 41.81,25.3 41.81,23.12 41.68,22.99 41.68,21.41 41.81,21.27 41.81,20.69 42.15,20.35 | 42.15,20.35 42.44,20.07 43.46,20.07 43.51,20.02 44.41,20.02 45.54,18.89 45.54,17.04 46.5,16.08 49.53,16.08 IC3.22 | v39.5,17.7 42.15,20.35 | KRZ.5 78,38.63 78,54.93 KRY.5 77.99,58.96 77.99,76.32 70.91,83.4 5.69,83.4 2.31,80.01 DPX.1 | JKBLEDA.3 16.51,6.4 15.47,7.44 15.47,13.06 v17.01,14.61
SEGBE
  Top 0.254: IC3.21 52.07,16.08 43.99,16.08 43.4,16.67 43.4,22.61 42.66,23.35 | 42.66,23.35 33.8,23.35 D3Z.1 30.18,23.83 20.62,23.83 D2Z.1 17.46,23.82 7.93,23.82 D1Z.1 3.58,25.4 2.31,26.67 DNZ.1 | D4Z.1 42.66,23.61 42.66,23.35 | D4Y.1 45.48,44.69 49.97,44.69 50.8,45.51 50.8,45.98 51.63,46.8 56.07,46.8 D5Y.1
  Bottom 0.254: 56.11,26.44 D5Z.1 | IC3.21 52.07,22.67 53.34,23.94 53.34,25.65 54.13,26.44 56.11,26.44 | 56.11,26.44 56.11,44.68 D5Y.1
SEGBF
  Top 0.254: DIZ.1 68.81,39.37 68.53,39.08 61.25,39.08 D5Z.9 57.63,38.58 49.05,38.58 D4Z.9 44.92,38.57 36.36,38.57 D3Z.9 32.23,38.58 23.65,38.58 D2Z.9 19.51,38.56 10.97,38.56 D1Z.9 | D5Y.9 58.64,59.91 56.66,59.91 55.88,60.69 55.88,61.17 55.06,61.99 48.02,61.99 D4Y.9
  Bottom 0.254: DIZ.1 69.85,38.34 68.81,37.3 68.81,20.99 67.31,19.48 IC3.15 | D4Z.9 45.94,41.69 45.94,46.7 46.99,47.75 D4Y.9 | 69.85,62.04 69.85,60.73 DIY.1 | 69.85,62.04 70.89,63.07 70.89,77.94 69.85,78.97 DIX.1 | 69.85,62.04 60.77,62.04 D5Y.9
SEGBG
  Top 0.254: DMY.1 69.85,41.69 67.76,39.6 66.88,39.6 66.22,40.26 66.22,40.66 64.67,42.2 58.71,42.2 D5Z.10 56.11,39.6 54.17,39.6 53.34,40.43 53.34,40.91 52.01,42.24 46.05,42.24 D4Z.10 43.4,39.59 41.49,39.59 40.85,40.23 40.85,40.62 39.27,42.2 33.31,42.2 D3Z.10 30.71,39.6 28.76,39.6 27.94,40.42 27.94,40.91 26.65,42.2 20.61,42.2 D2Z.10 17.98,39.57 16.04,39.57 15.24,40.37 15.24,40.86 14.38,41.72 7.43,41.72 D1Z.10 | DMZ.1 69.85,25.64 63.7,19.48 62.23,19.48 IC3.17 | D5Y.10 55.61,62.5 45.99,62.5 D4Y.10
  Bottom 0.254: DMX.1 69.85,66.28 68.58,65 62.27,65 58.17,60.9 | 58.17,60.9 57.21,60.9 D5Y.10 | D5Z.10 58.19,41.68 58.19,60.88 58.17,60.9 | DMY.1 69.85,45.95 70.89,44.92 70.89,28.74 69.85,27.7 DMZ.1
VCC
  Top 0.254: 92.71,57.15 87.63,62.23 R6.2 86.13,66.04 R3.2 | IC1.20 94.82,33.02 94.82,31.67 89.59,26.44 87.17,26.44 86.13,25.4 R5.2 | 92.71,57.15 92.71,56.24 89.99,53.52 88.15,53.52 86.79,52.16 86.79,48.46 85.09,46.76 R4.2 | 92.71,57.15 94.82,57.15 IC4.16 | R2.2 54.38,21.59 56.49,19.48 57.15,19.48 IC3.19 | C2.+ 36.83,16.51 34.06,16.51 C1.1 31.98,16.51 29.37,13.9 16.15,13.9 13.97,16.08 IC2.19 | JPOWER.2 64.72,2.54 67.26,5.08 JBUS.2 70.62,7.12 71.52,7.12 74.42,10.02 74.42,11.12 78.53,15.24 C4.+
  Bottom 0.254: 81.28,16.51 84.58,19.81 84.58,23.85 85.09,24.36 R5.2 85.09,26.44 85.09,44.68 R4.2 | 56.06,11.89 55.75,12.2 55.75,15.41 56.42,16.08 57.15,16.08 IC3.19 | 56.06,11.89 56.06,9.44 55.07,8.46 50.55,8.46 49.98,7.88 44.57,7.88 38.1,14.35 C2.+ | JPOWER.2 58.25,5.25 58.25,11.21 57.57,11.89 56.06,11.89 | R1.2 11.2,21.59 13.31,19.48 13.97,19.48 IC2.19 13.97,17.54 13.97,16.08 14.3,15.74 14.3,12.72 12.92,11.33 12.92,7.45 13.97,6.4 JKBLEDA.5 | 81.28,16.51 C4.+ | 81.28,16.51 77.24,16.51 C3.1
X_DIR  (via drill 0.3 pad 0.61)
  Top 0.254: v92.31,16.21 92.31,8.07 93.98,6.4 JDRO.3
  Bottom 0.254: v92.31,16.21 92.05,16.48 92.05,29.03 90.6,30.48 IC1.2
X_STEP
  Bottom 0.254: IC1.3 90.6,27.94 90.6,19.86 89.79,19.05 88.01,19.05 87.2,18.24 87.2,12.26 88.03,11.43 90.17,11.43 JDRO.1
Y_DIR
  Top 0.254: IC1.6 87.2,20.32 87.2,8.1 88.9,6.4 JDRO.7
Y_STEP
  Top 0.254: IC1.7 90.6,17.78 90.6,7.24 91.44,6.4 JDRO.5
Z_DIR
  Bottom 0.254: IC1.8 90.6,15.24 90.6,13.69 98.37,5.92 98.37,2.5 97.09,1.21 95.31,1.21 JDRO.4
Z_STEP
  Bottom 0.254: JDRO.2 97.86,3.88 97.86,5.63 90.8,12.7 IC1.9

### Text on the board
Top: TOPC
Bottom: BOTC | 20130528
tPlace: TOPS | 1 | 1 | 1 | 1 | 1 | CNC-CP-DB-20130528 | 1 | 1 | 1 | 1 | 1 | (C) 2013 Radu - Eosif Mihailescu | 1 | 1 | 1 | 1 | 1 | + | - | OSHW
bPlace: BOTS